# Altium project Player-Mini.PrjPcb
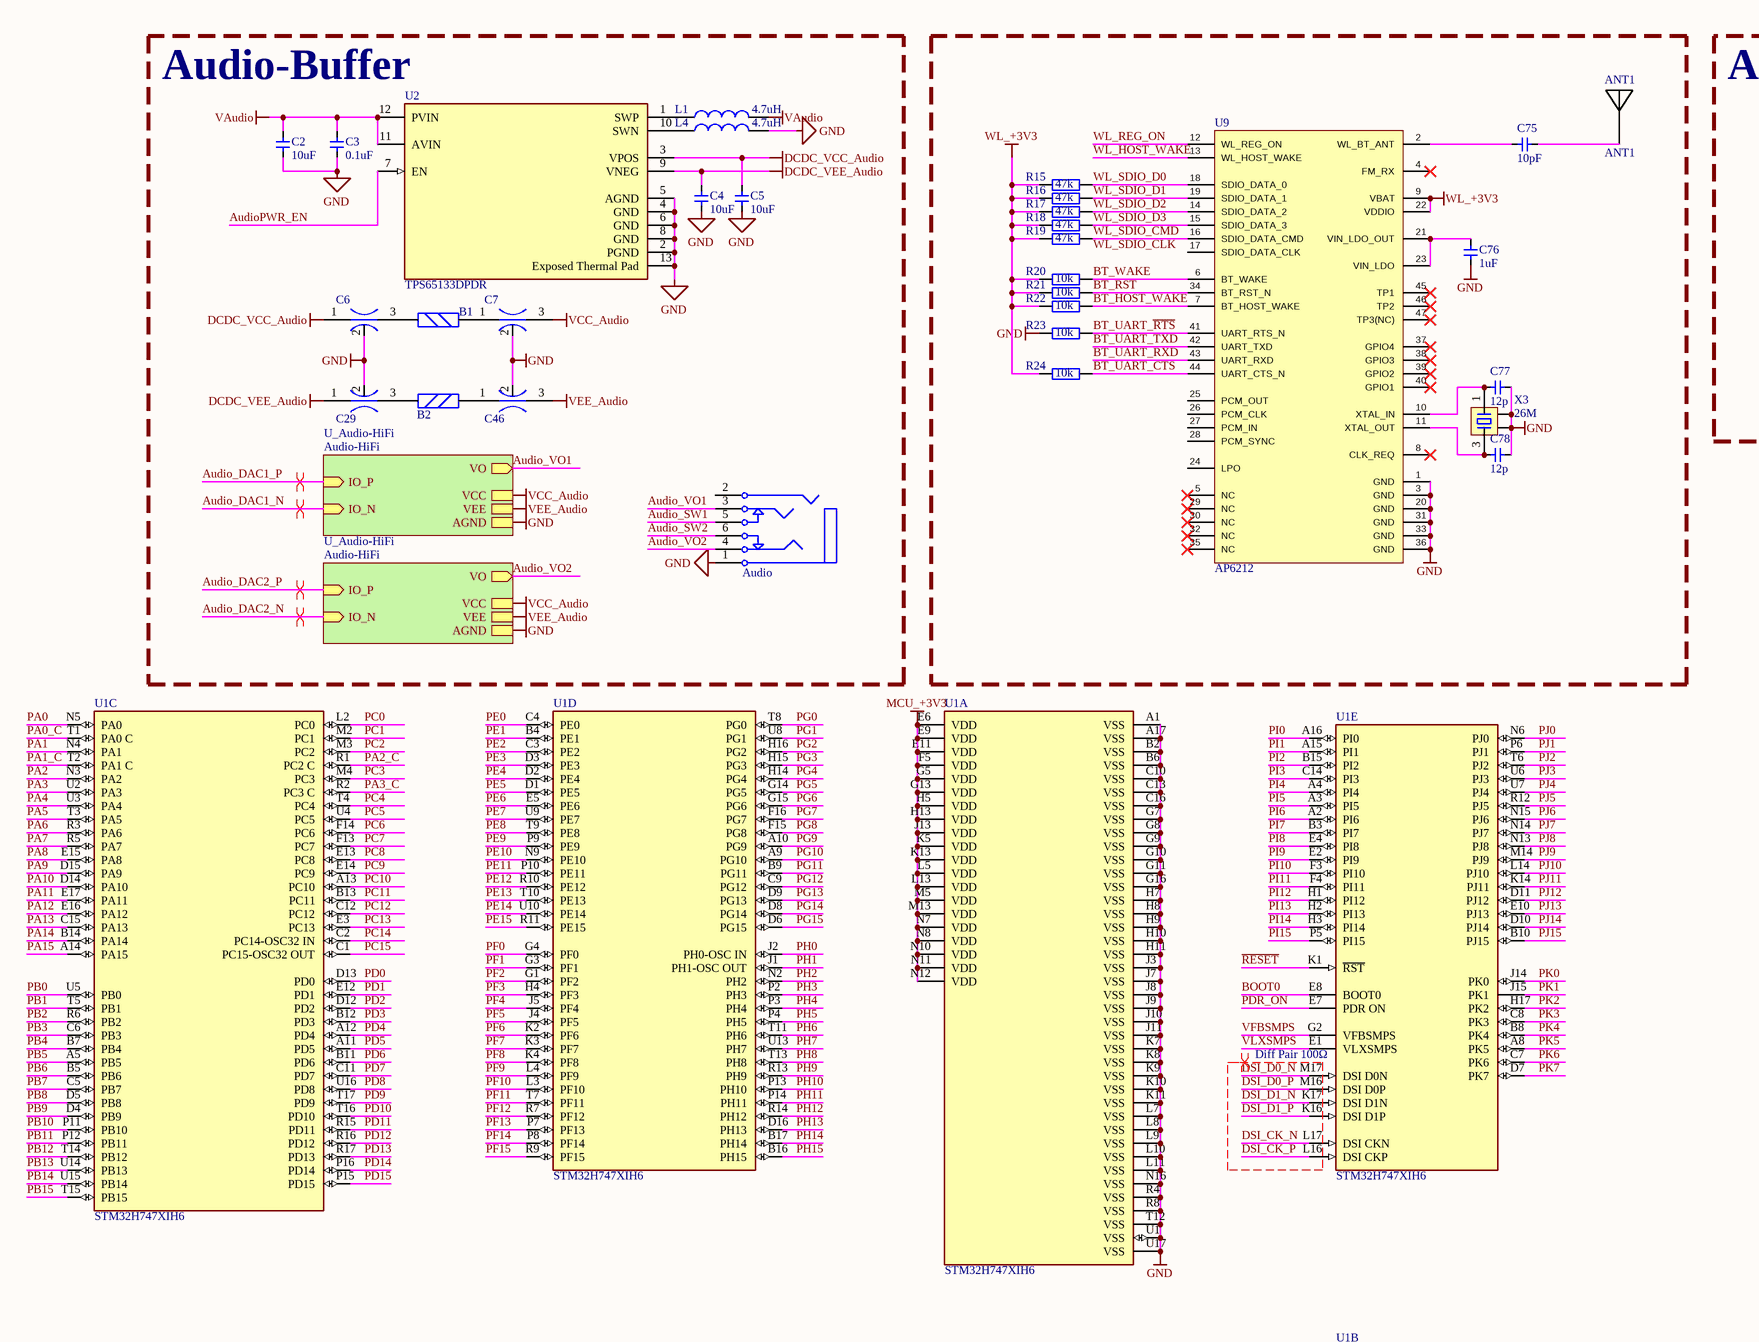
[diagram p0: Player.SchDoc, top middle]
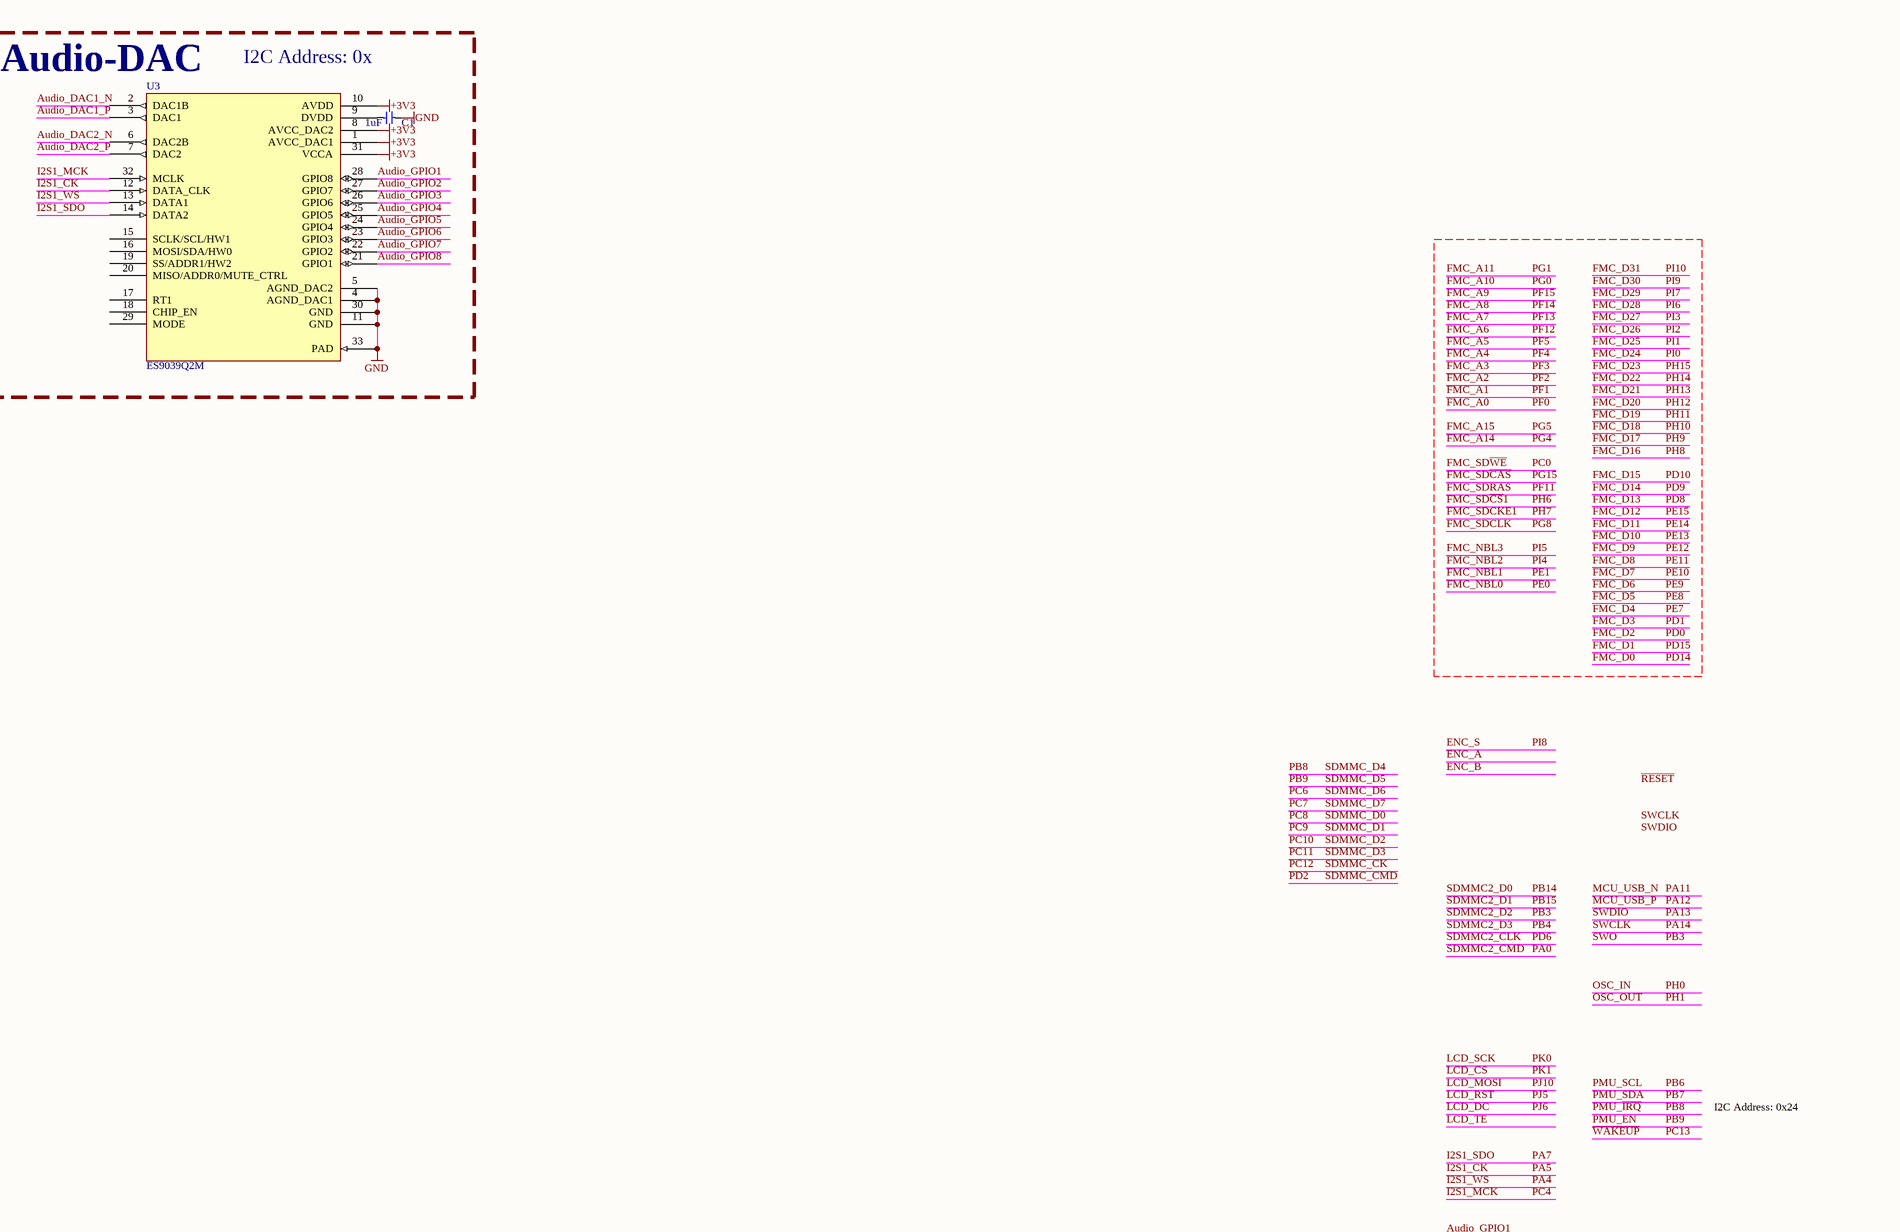
[diagram p1: Player.SchDoc, top right]
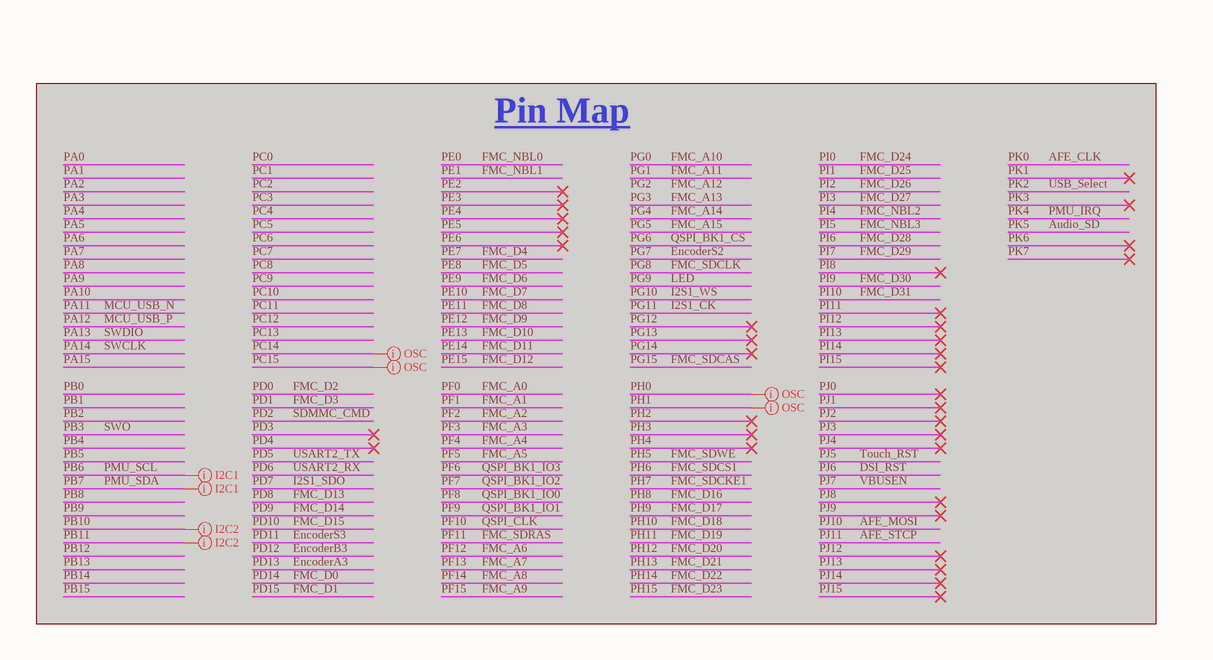
[diagram p2: Player.SchDoc, bottom left]
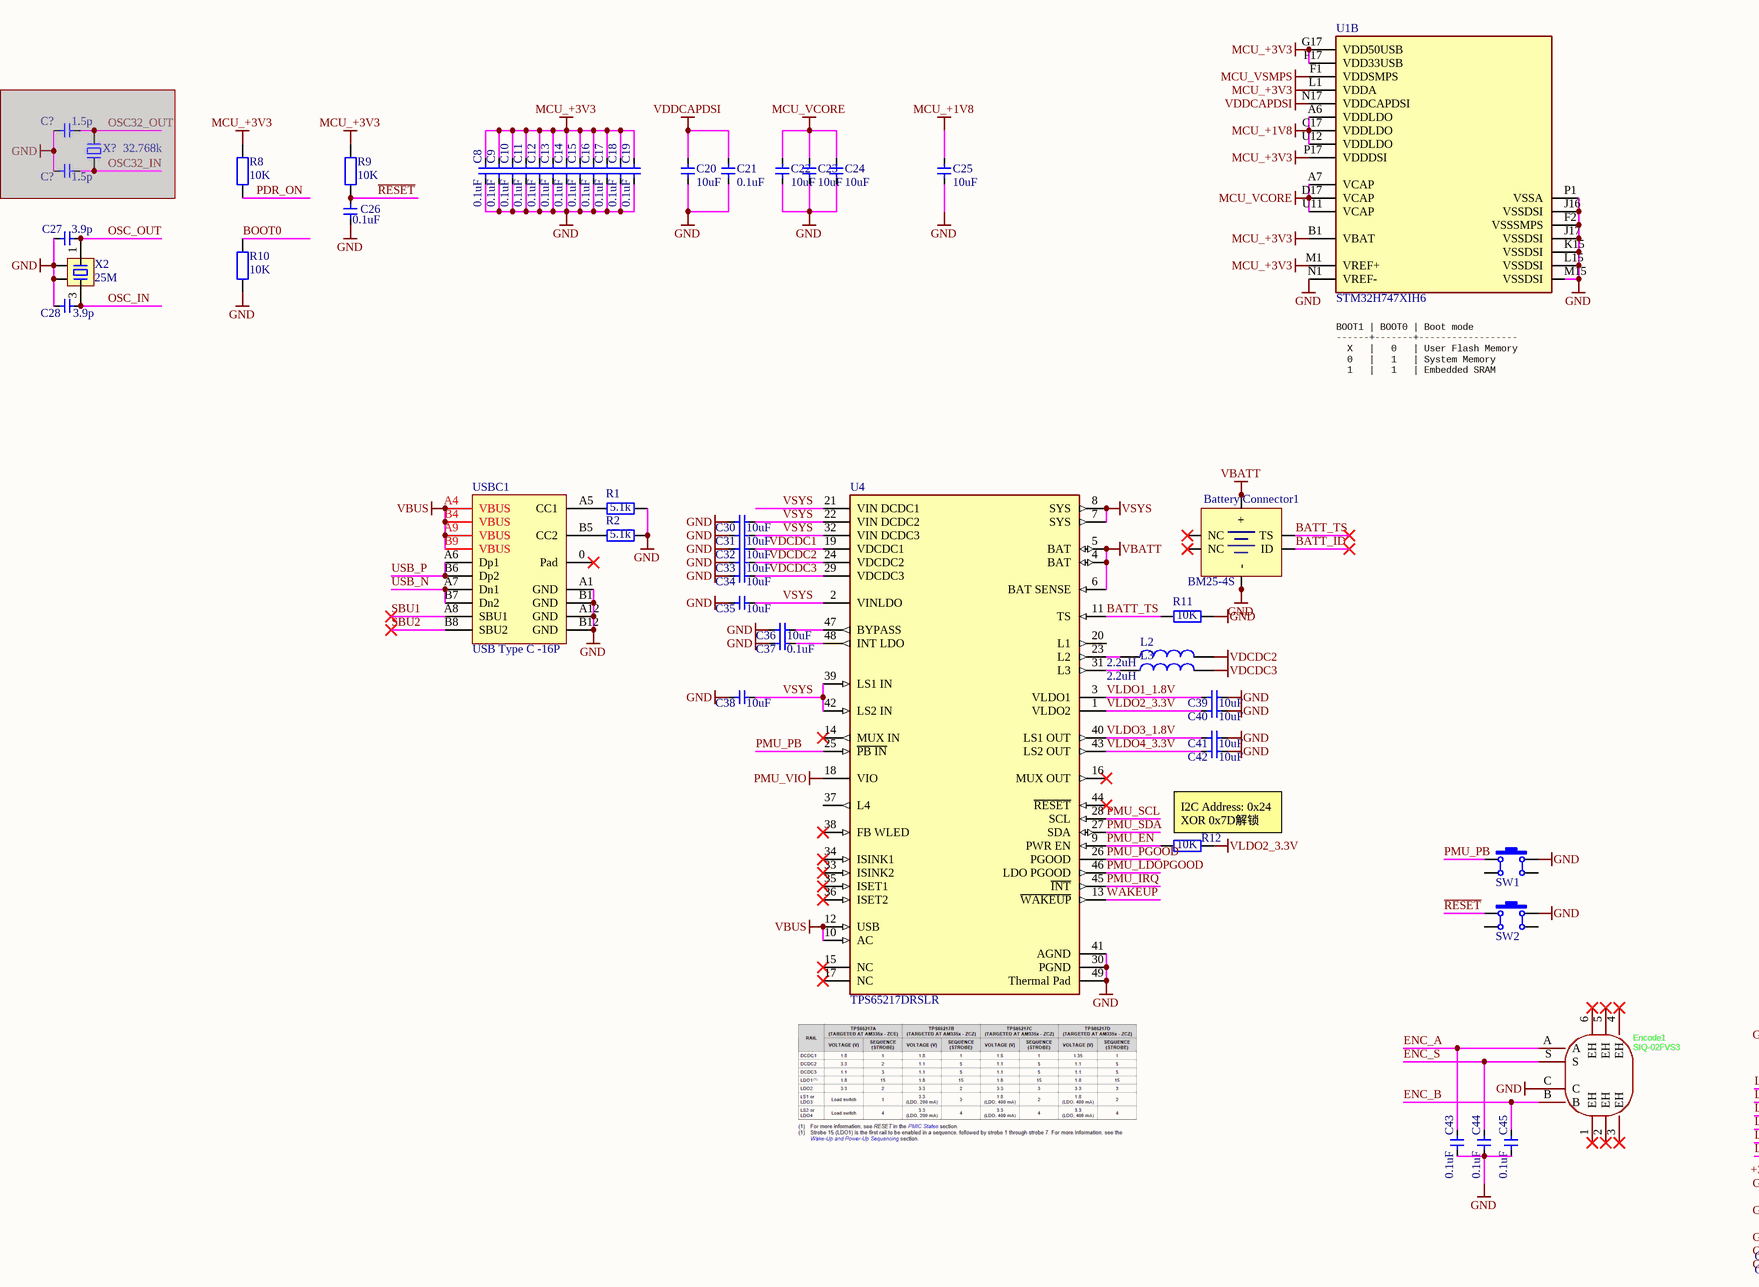
[diagram p3: Player.SchDoc, bottom middle]
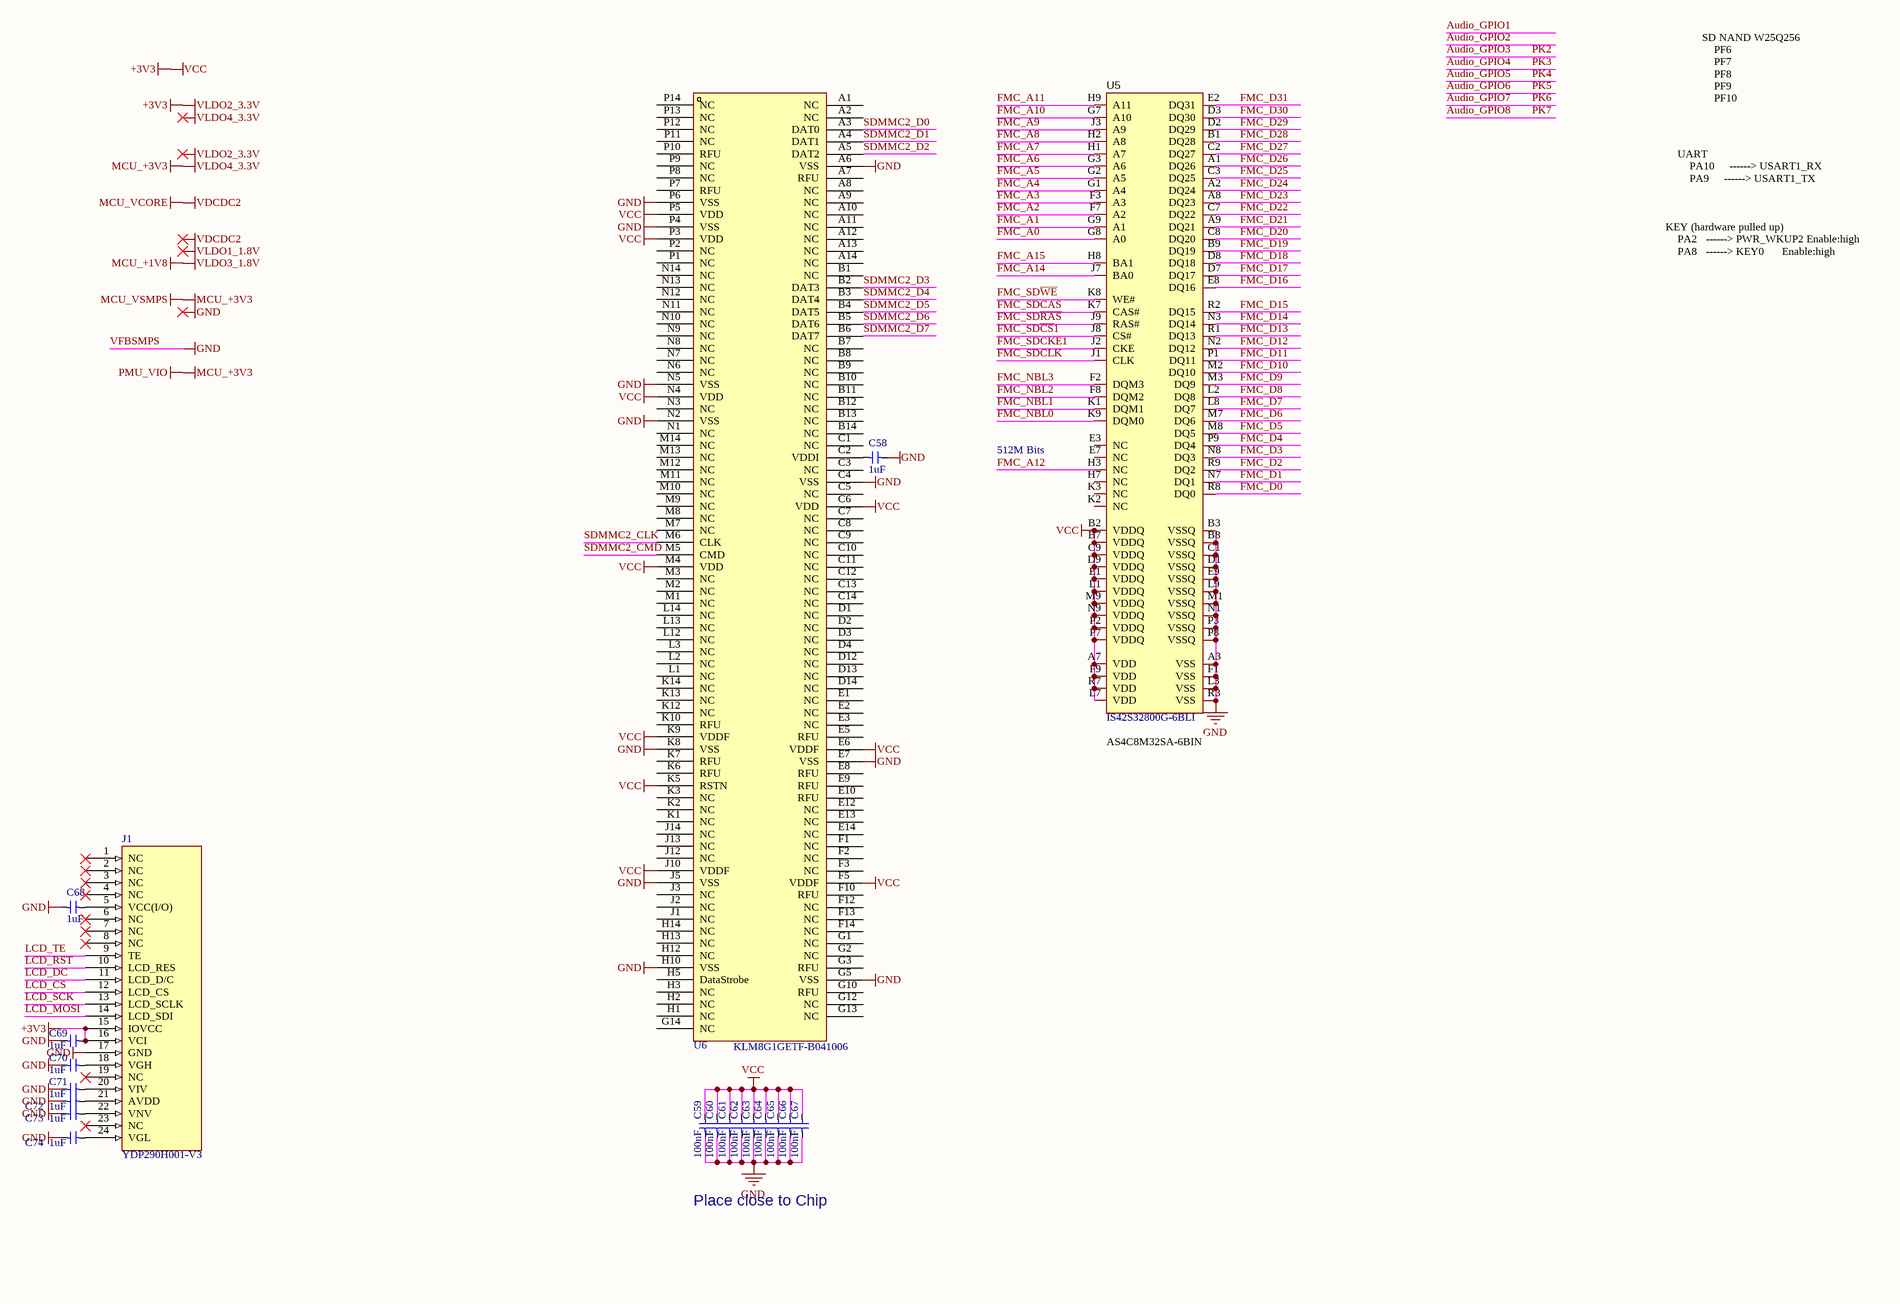
[diagram p4: Player.SchDoc, bottom right]
1 sheet, 110 parts. Net scope: hierarchical (ports join the sheet entries above them; power ports are global).
Board file: Player.PcbDoc

## Sheet Player.SchDoc
size 762 x 508 mm; SheetNumber: 1; SheetTotal: 2

### Parts
(Parts that share a designator on the sheet are numbered #1, #2 ... from top to bottom, then left to right.)
ANT1  ANT1  [2.4GANTS9]
Audio  PJ342  [PJ342A]  (value not drawn)
B1  BLM15AG601SN1D  [L0603]  (value not drawn)
B2  BLM15AG601SN1D  [L0603]  (value not drawn)
Battery_Connector1  BM25-4S  [BM25-4S/2-V-51]
C1  1uF  [0402-C]
C2  10uF  [0402-C]
C3  0.1uF  [0402-C]
C4  10uF  [0402-C]
C5  10uF  [0402-C]
C6  NFM18PS105D0J3D  [FP-NFM18-0_1-e0_05_0_35-MFG]  (value not drawn)
C7  NFM18PS105D0J3D  [FP-NFM18-0_1-e0_05_0_35-MFG]  (value not drawn)
C8  0.1uF  [0402-C]
C9  0.1uF  [0402-C]
C10  0.1uF  [0402-C]
C11  0.1uF  [0402-C]
C12  0.1uF  [0402-C]
C13  0.1uF  [0402-C]
C14  0.1uF  [0402-C]
C15  0.1uF  [0402-C]
C16  0.1uF  [0402-C]
C17  0.1uF  [0402-C]
C18  0.1uF  [0402-C]
C19  0.1uF  [0402-C]
C20  10uF  [0402-C]
C21  0.1uF  [0402-C]
C22  10uF  [0402-C]
C23  10uF  [0402-C]
C24  10uF  [0402-C]
C25  10uF  [0402-C]
C26  0.1uF  [0402-C]
C27  3.9p  [0402-C]
C28  3.9p  [0402-C]
C29  NFM18PS105D0J3D  [FP-NFM18-0_1-e0_05_0_35-MFG]  (value not drawn)
C30  10uF  [0402-C]
C31  10uF  [0402-C]
C32  10uF  [0402-C]
C33  10uF  [0402-C]
C34  10uF  [0402-C]
C35  10uF  [0402-C]
C36  10uF  [0402-C]
C37  0.1uF  [0402-C]
C38  10uF  [0402-C]
C39  10uF  [0402-C]
C40  10uF  [0402-C]
C41  10uF  [0402-C]
C42  10uF  [0402-C]
C43  0.1uF  [0402-C]
C44  0.1uF  [0402-C]
C45  0.1uF  [0402-C]
C46  NFM18PS105D0J3D  [FP-NFM18-0_1-e0_05_0_35-MFG]  (value not drawn)
C58  1uF  [0402-C]
C59  100nF  [0402-C]
C60  100nF  [0402-C]
C61  100nF  [0402-C]
C62  100nF  [0402-C]
C63  100nF  [0402-C]
C64  100nF  [0402-C]
C65  100nF  [0402-C]
C66  100nF  [0402-C]
C67  100nF  [0402-C]
C68  1uF  [0402-C]
C69  1uF  [0402-C]
C70  1uF  [0402-C]
C71  1uF  [0402-C]
C72  1uF  [0402-C]
C73  1uF  [0402-C]
C74  1uF  [0402-C]
C75  10pF  [0402-C]
C76  1uF  [0402-C]
C77  12p  [0402-C]
C78  12p  [0402-C]
C?#1  1.5p  [0402-C]  (masked out: inside a compile mask, not in the netlist)
C?#2  1.5p  [0402-C]  (masked out: inside a compile mask, not in the netlist)
Encode1  SIQ-02FVS3  [SW-SMD_SIQ-02FVS3_1]
J1  YDP290H001-V3  [FPC0.5-WT-24P]
L1  4.7uH  [L0805]
L2  2.2uH  [L0805]
L3  2.2uH  [L0805]
L4  4.7uH  [L0805]
R1  5.1k  [0603-R]
R2  5.1k  [0603-R]
R8  10K  [0603-R]
R9  10K  [0603-R]
R10  10K  [0603-R]
R11  10K  [0603-R]
R12  10K  [0603-R]
R15  47k  [0603-R]
R16  47k  [0603-R]
R17  47k  [0603-R]
R18  47k  [0603-R]
R19  47k  [0603-R]
R20  10k  [0603-R]
R21  10k  [0603-R]
R22  10k  [0603-R]
R23  10k  [0603-R]
R24  10k  [0603-R]
SW1  TD-1187SA-250  [SW-SMD-3.5*3.0_4P]  (value not drawn)
SW2  TD-1187SA-250  [SW-SMD-3.5*3.0_4P]  (value not drawn)
U1  STM32H747XIH6  [FP-TFBGA240+25-A07U-MFG]  (parts A,B,C,D,E of 5)
U2  TPS65133DPDR  [FP-DPD0012A-MFG]
U3  ES9039Q2M  [QFN32 5x5_L]
U4  TPS65217DRSLR  [FP-RSL0048A-MFG]
U5  IS42S32800G-6BLI  [BGA-90_L13.0-W8.0-R6-C15-P0.80-TL]
U6  KLM8G1GETF-B041006  [FBGA-153_L13.0-W11.5-P0.50_KLMAG1JETD-B041]
U9  AP6212  [QFN-44_L12.0-W12.0-P0.90-TL]
USBC1  USB Type C -16P  [USB-C-SMD_16P]
X2  25M  [XTAL-3225-4P]
X3  26M  [XTAL-3225-4P]
X?  32.768k  [XTAL-3215-2P]  (masked out: inside a compile mask, not in the netlist)

### Blocks framed on the sheet
Audio-Buffer: Audio B1 B2 C2-C7 C29 C46 L1 L4 U2
Audio-DAC: C1 U3

### Sub-sheets
U_Audio-HiFi = Audio-HiFi (file not in this document): IO_N (in), IO_P (in), VO (out), VCC, VEE, AGND
U_Audio-HiFi = Audio-HiFi (file not in this document): IO_N (in), IO_P (in), VO (out), VCC, VEE, AGND

### Nets
DCDC_VCC_Audio: C5.2 C6.1(Input) U2.3(VPOS)
DCDC_VEE_Audio: C4.2 C29.1(Input) U2.9(VNEG)
VAudio: C2.2 C3.2 L1.2 U2.11(AVIN) U2.12(PVIN)
VBATT: Battery_Connector1.1(+) Battery_Connector1.2(+) Battery_Connector1.9(+) Battery_Connector1.10(+) Battery_Connector1.13(+) Battery_Connector1.14(+) U4.4(BAT) U4.5(BAT) U4.6(BAT_SENSE)
VBUS: U4.10(AC) U4.12(USB) USBC1.A4(VBUS) USBC1.A9(VBUS) USBC1.B4(VBUS) USBC1.B9(VBUS)
VCC_Audio: C7.3(Output) ; sheet U_Audio-HiFi/VCC, sheet U_Audio-HiFi/VCC
VDCDC2: C22.2 C23.2 C24.2 C33.1 L2.2 U1.A7(VCAP) U1.D17(VCAP) U1.U11(VCAP) U4.24(VDCDC2)  [also labelled MCU_VCORE]
VDCDC3: C34.1 L3.2 U4.29(VDCDC3)
VDDCAPDSI: C20.2 C21.2 U1.N17(VDDCAPDSI)
VEE_Audio: C46.3(Output) ; sheet U_Audio-HiFi/VEE, sheet U_Audio-HiFi/VEE
VFBSMPS: Audio.1 Battery_Connector1.7(-) Battery_Connector1.8(-) Battery_Connector1.11(-) Battery_Connector1.12(-) Battery_Connector1.15(-) Battery_Connector1.16(-) C1.2 C2.1 C3.1 C4.1 C5.1 C6.2(GND) C7.2(GND) C8.2 C9.2 C10.2 C11.2 C12.2 C13.2 C14.2 C15.2 C16.2 C17.2 C18.2 C19.2 C20.1 C21.1 C22.1 C23.1 C24.1 C25.2 C26.2 C27.2 C28.2 C29.2(GND) C30.2 C31.2 C32.2 C33.2 C34.2 C35.2 C36.2 C37.2 C38.2 C39.1 C40.1 C41.1 C42.1 C43.2 C44.2 C45.2 C46.2(GND) C58.2 C59.2 C60.2 C61.2 C62.2 C63.2 C64.2 C65.2 C66.2 C67.2 C68.1 C69.1 C70.1 C71.1 C72.1 C73.1 C74.1 C76.1 C77.2 C78.2 Encode1.C J1.17(GND) L4.2 R1.2 R2.2 R10.1 R11.2 R23.1 SW1.2 SW2.2 U1.A1(VSS) U1.A17(VSS) U1.B2(VSS) U1.B6(VSS) U1.C10(VSS) U1.C13(VSS) U1.C16(VSS) U1.F2(VSSSMPS) U1.G2(VFBSMPS) U1.G7(VSS) U1.G8(VSS) U1.G9(VSS) U1.G10(VSS) U1.G11(VSS) U1.G16(VSS) U1.H7(VSS) U1.H8(VSS) U1.H9(VSS) U1.H10(VSS) U1.H11(VSS) U1.J3(VSS) U1.J7(VSS) U1.J8(VSS) U1.J9(VSS) U1.J10(VSS) U1.J11(VSS) U1.J16(VSSDSI) U1.J17(VSSDSI) U1.K7(VSS) U1.K8(VSS) U1.K9(VSS) U1.K10(VSS) U1.K11(VSS) U1.K15(VSSDSI) U1.L7(VSS) U1.L8(VSS) U1.L9(VSS) U1.L10(VSS) U1.L11(VSS) U1.L15(VSSDSI) U1.M15(VSSDSI) U1.N1(VREF-) U1.N16(VSS) U1.P1(VSSA) U1.R4(VSS) U1.R8(VSS) U1.T12(VSS) U1.U1(VSS) U1.U17(VSS) U2.2(PGND) U2.4(GND) U2.5(AGND) U2.6(GND) U2.8(GND) U2.13(Exposed_Thermal_Pad) U3.4(AGND_DAC1) U3.5(AGND_DAC2) U3.11(GND) U3.30(GND) U3.33(PAD) U4.30(PGND) U4.41(AGND) U4.49(Thermal_Pad) U5.A3(VSS) U5.B3(VSSQ) U5.B8(VSSQ) U5.C1(VSSQ) U5.D1(VSSQ) U5.E9(VSSQ) U5.F1(VSS) U5.L3(VSS) U5.L9(VSSQ) U5.M1(VSSQ) U5.N1(VSSQ) U5.P3(VSSQ) U5.P8(VSSQ) U5.R3(VSS) U6.A6(VSS) U6.C4(VSS) U6.E7(VSS) U6.G5(VSS) U6.H10(VSS) U6.J5(VSS) U6.K8(VSS) U6.N2(VSS) U6.N5(VSS) U6.P4(VSS) U6.P6(VSS) U9.1(GND) U9.3(GND) U9.20(GND) U9.31(GND) U9.33(GND) U9.36(GND) USBC1.A1(GND) USBC1.A12(GND) USBC1.B1(GND) USBC1.B12(GND) X2.2 X2.4 X3.2 X3.4 ; sheet U_Audio-HiFi/AGND, sheet U_Audio-HiFi/AGND  [also labelled GND]
VLDO1_1.8V: C39.2 U4.3(VLDO1)
VLDO2_3.3V: C40.2 C59.1 C60.1 C61.1 C62.1 C63.1 C64.1 C65.1 C66.1 C67.1 C69.2 J1.15(IOVCC) J1.16(VCI) R12.2 U3.1(AVCC_DAC1) U3.8(AVCC_DAC2) U3.10(AVDD) U3.31(VCCA) U4.1(VLDO2) U5.A7(VDD) U5.B2(VDDQ) U5.B7(VDDQ) U5.C9(VDDQ) U5.D9(VDDQ) U5.E1(VDDQ) U5.F9(VDD) U5.L1(VDDQ) U5.L7(VDD) U5.M9(VDDQ) U5.N9(VDDQ) U5.P2(VDDQ) U5.P7(VDDQ) U5.R7(VDD) U6.C6(VDD) U6.E6(VDDF) U6.F5(VDDF) U6.J10(VDDF) U6.K5(RSTN) U6.K9(VDDF) U6.M4(VDD) U6.N4(VDD) U6.P3(VDD) U6.P5(VDD)  [also labelled +3V3, VCC]
VLDO3_1.8V: C25.1 C41.2 U1.A6(VDDLDO) U1.C17(VDDLDO) U1.U12(VDDLDO) U4.40(LS1_OUT)  [also labelled MCU_+1V8]
VLDO4_3.3V: C8.1 C9.1 C10.1 C11.1 C12.1 C13.1 C14.1 C15.1 C16.1 C17.1 C18.1 C19.1 C42.2 R8.2 R9.2 U1.B1(VBAT) U1.E6(VDD) U1.E9(VDD) U1.E11(VDD) U1.F1(VDDSMPS) U1.F5(VDD) U1.F17(VDD33USB) U1.G5(VDD) U1.G13(VDD) U1.G17(VDD50USB) U1.H5(VDD) U1.H13(VDD) U1.J13(VDD) U1.K5(VDD) U1.K13(VDD) U1.L1(VDDA) U1.L5(VDD) U1.L13(VDD) U1.M1(VREF+) U1.M5(VDD) U1.M13(VDD) U1.N7(VDD) U1.N8(VDD) U1.N10(VDD) U1.N11(VDD) U1.N12(VDD) U1.P17(VDDDSI) U4.18(VIO) U4.43(LS2_OUT)  [also labelled MCU_+3V3, MCU_VSMPS, PMU_VIO]
VSYS: C30.1 C31.1 C35.1 C38.1 U4.2(VINLDO) U4.7(SYS) U4.8(SYS) U4.21(VIN_DCDC1) U4.22(VIN_DCDC2) U4.32(VIN_DCDC3) U4.39(LS1_IN) U4.42(LS2_IN)
WL_+3V3: R15.1 R16.1 R17.1 R18.1 R19.1 R20.1 R21.1 R22.1 R24.1 U9.9(VBAT) U9.22(VDDIO)
Audio_DAC1_N: U3.2(DAC1B) ; sheet U_Audio-HiFi/IO_N
Audio_DAC1_P: U3.3(DAC1) ; sheet U_Audio-HiFi/IO_P
Audio_DAC2_N: U3.6(DAC2B) ; sheet U_Audio-HiFi/IO_N
Audio_DAC2_P: U3.7(DAC2) ; sheet U_Audio-HiFi/IO_P
Audio_GPIO1: U3.28(GPIO8)
Audio_GPIO2: U3.27(GPIO7)
Audio_GPIO3: U1.H17(PK2) U3.26(GPIO6)  [also labelled PK2]
Audio_GPIO4: U1.C8(PK3) U3.25(GPIO5)  [also labelled PK3]
Audio_GPIO5: U1.B8(PK4) U3.24(GPIO4)  [also labelled PK4]
Audio_GPIO6: U1.A8(PK5) U3.23(GPIO3)  [also labelled PK5]
Audio_GPIO7: U1.C7(PK6) U3.22(GPIO2)  [also labelled PK6]
Audio_GPIO8: U1.D7(PK7) U3.21(GPIO1)  [also labelled PK7]
Audio_SW1: Audio.5
Audio_SW2: Audio.6
Audio_VO1: Audio.3 ; sheet U_Audio-HiFi/VO
Audio_VO2: Audio.4 ; sheet U_Audio-HiFi/VO
AudioPWR_EN: U2.7(EN)
BATT_ID: Battery_Connector1.4(ID)
BATT_TS: Battery_Connector1.3(TS) R11.1 U4.11(TS)
BOOT0: R10.2 U1.E8(BOOT0)
BT_HOST_WAKE: R22.2 U9.7(BT_HOST_WAKE)
BT_~{RST}: R21.2 U9.34(BT_RST_N)
BT_UART_~{CTS}: R24.2 U9.44(UART_CTS_N)
BT_UART_~{RTS}: R23.2 U9.41(UART_RTS_N)
BT_UART_RXD: U9.43(UART_RXD)
BT_UART_TXD: U9.42(UART_TXD)
BT_WAKE: R20.2 U9.6(BT_WAKE)
DSI_CK_N: U1.L17(DSI_CKN)
DSI_CK_P: U1.L16(DSI_CKP)
DSI_D0_N: U1.M17(DSI_D0N)
DSI_D0_P: U1.M16(DSI_D0P)
DSI_D1_N: U1.K17(DSI_D1N)
DSI_D1_P: U1.K16(DSI_D1P)
ENC_A: C43.1 Encode1.A
ENC_B: C45.1 Encode1.B
ENC_S: C44.1 Encode1.S U1.E4(PI8)  [also labelled PI8]
FMC_A0: U1.G4(PF0) U5.G8(A0)  [also labelled PF0]
FMC_A1: U1.G3(PF1) U5.G9(A1)  [also labelled PF1]
FMC_A2: U1.G1(PF2) U5.F7(A2)  [also labelled PF2]
FMC_A3: U1.H4(PF3) U5.F3(A3)  [also labelled PF3]
FMC_A4: U1.J5(PF4) U5.G1(A4)  [also labelled PF4]
FMC_A5: U1.J4(PF5) U5.G2(A5)  [also labelled PF5]
FMC_A6: U1.R7(PF12) U5.G3(A6)  [also labelled PF12]
FMC_A7: U1.P7(PF13) U5.H1(A7)  [also labelled PF13]
FMC_A8: U1.P8(PF14) U5.H2(A8)  [also labelled PF14]
FMC_A9: U1.R9(PF15) U5.J3(A9)  [also labelled PF15]
FMC_A10: U1.T8(PG0) U5.G7(A10)  [also labelled PG0]
FMC_A11: U1.U8(PG1) U5.H9(A11)  [also labelled PG1]
FMC_A12: U5.H3(NC)
FMC_A14: U1.H14(PG4) U5.J7(BA0)  [also labelled PG4]
FMC_A15: U1.G14(PG5) U5.H8(BA1)  [also labelled PG5]
FMC_D0: U1.P16(PD14) U5.R8(DQ0)  [also labelled PD14]
FMC_D1: U1.P15(PD15) U5.N7(DQ1)  [also labelled PD15]
FMC_D2: U1.D13(PD0) U5.R9(DQ2)  [also labelled PD0]
FMC_D3: U1.E12(PD1) U5.N8(DQ3)  [also labelled PD1]
FMC_D4: U1.U9(PE7) U5.P9(DQ4)  [also labelled PE7]
FMC_D5: U1.T9(PE8) U5.M8(DQ5)  [also labelled PE8]
FMC_D6: U1.P9(PE9) U5.M7(DQ6)  [also labelled PE9]
FMC_D7: U1.N9(PE10) U5.L8(DQ7)  [also labelled PE10]
FMC_D8: U1.P10(PE11) U5.L2(DQ8)  [also labelled PE11]
FMC_D9: U1.R10(PE12) U5.M3(DQ9)  [also labelled PE12]
FMC_D10: U1.T10(PE13) U5.M2(DQ10)  [also labelled PE13]
FMC_D11: U1.U10(PE14) U5.P1(DQ11)  [also labelled PE14]
FMC_D12: U1.R11(PE15) U5.N2(DQ12)  [also labelled PE15]
FMC_D13: U1.U16(PD8) U5.R1(DQ13)  [also labelled PD8]
FMC_D14: U1.T17(PD9) U5.N3(DQ14)  [also labelled PD9]
FMC_D15: U1.T16(PD10) U5.R2(DQ15)  [also labelled PD10]
FMC_D16: U1.T13(PH8) U5.E8(DQ16)  [also labelled PH8]
FMC_D17: U1.R13(PH9) U5.D7(DQ17)  [also labelled PH9]
FMC_D18: U1.P13(PH10) U5.D8(DQ18)  [also labelled PH10]
FMC_D19: U1.P14(PH11) U5.B9(DQ19)  [also labelled PH11]
FMC_D20: U1.R14(PH12) U5.C8(DQ20)  [also labelled PH12]
FMC_D21: U1.D16(PH13) U5.A9(DQ21)  [also labelled PH13]
FMC_D22: U1.B17(PH14) U5.C7(DQ22)  [also labelled PH14]
FMC_D23: U1.B16(PH15) U5.A8(DQ23)  [also labelled PH15]
FMC_D24: U1.A16(PI0) U5.A2(DQ24)  [also labelled PI0]
FMC_D25: U1.A15(PI1) U5.C3(DQ25)  [also labelled PI1]
FMC_D26: U1.B15(PI2) U5.A1(DQ26)  [also labelled PI2]
FMC_D27: U1.C14(PI3) U5.C2(DQ27)  [also labelled PI3]
FMC_D28: U1.A2(PI6) U5.B1(DQ28)  [also labelled PI6]
FMC_D29: U1.B3(PI7) U5.D2(DQ29)  [also labelled PI7]
FMC_D30: U1.E2(PI9) U5.D3(DQ30)  [also labelled PI9]
FMC_D31: U1.F3(PI10) U5.E2(DQ31)  [also labelled PI10]
FMC_NBL0: U1.C4(PE0) U5.K9(DQM0)  [also labelled PE0]
FMC_NBL1: U1.B4(PE1) U5.K1(DQM1)  [also labelled PE1]
FMC_NBL2: U1.A4(PI4) U5.F8(DQM2)  [also labelled PI4]
FMC_NBL3: U1.A3(PI5) U5.F2(DQM3)  [also labelled PI5]
FMC_SD~{CAS}: U1.D6(PG15) U5.K7(CAS#)  [also labelled PG15]
FMC_SD~{CS}1: U1.T11(PH6) U5.J8(CS#)  [also labelled PH6]
FMC_SDCKE1: U1.U13(PH7) U5.J2(CKE)  [also labelled PH7]
FMC_SDCLK: U1.F15(PG8) U5.J1(CLK)  [also labelled PG8]
FMC_SD~{RAS}: U1.T7(PF11) U5.J9(RAS#)  [also labelled PF11]
FMC_SD~{WE}: U1.L2(PC0) U5.K8(WE#)  [also labelled PC0]
I2S1_CK: U1.T3(PA5) U3.12(DATA_CLK)  [also labelled PA5]
I2S1_MCK: U1.T4(PC4) U3.32(MCLK)  [also labelled PC4]
I2S1_SDO: U1.R5(PA7) U3.14(DATA2)  [also labelled PA7]
I2S1_WS: U1.U3(PA4) U3.13(DATA1)  [also labelled PA4]
LCD_CS: J1.12(LCD_CS) U1.J15(PK1)  [also labelled PK1]
LCD_DC: J1.11(LCD_D/C) U1.N15(PJ6)  [also labelled PJ6]
LCD_MOSI: J1.14(LCD_SDI) U1.L14(PJ10)  [also labelled PJ10]
LCD_RST: J1.10(LCD_RES) U1.R12(PJ5)  [also labelled PJ5]
LCD_SCK: J1.13(LCD_SCLK) U1.J14(PK0)  [also labelled PK0]
LCD_TE: J1.9(TE)
MCU_USB_N: U1.E17(PA11)  [also labelled PA11]
MCU_USB_P: U1.E16(PA12)  [also labelled PA12]
OSC_IN: C28.1 U1.J2(PH0-OSC_IN) X2.3  [also labelled PH0]
OSC_OUT: C27.1 U1.J1(PH1-OSC_OUT) X2.1  [also labelled PH1]
PA0: U1.N5(PA0) U6.M5(CMD)  [also labelled SDMMC2_CMD]
PA0_C: U1.T1(PA0_C)
PA1: U1.N4(PA1)
PA1_C: U1.T2(PA1_C)
PA2: U1.N3(PA2)
PA2_C: U1.R1(PC2_C)
PA3: U1.U2(PA3)
PA3_C: U1.R2(PC3_C)
PA6: U1.R3(PA6)
PA8: U1.E15(PA8)
PA9: U1.D15(PA9)
PA10: U1.D14(PA10)
PA13: U1.C15(PA13)  [also labelled SWDIO]
PA14: U1.B14(PA14)  [also labelled SWCLK]
PA15: U1.A14(PA15)
PB0: U1.U5(PB0)
PB1: U1.T5(PB1)
PB2: U1.R6(PB2)
PB3: U1.C6(PB3) U6.A5(DAT2)  [also labelled SDMMC2_D2, SWO]
PB4: U1.B7(PB4) U6.B2(DAT3)  [also labelled SDMMC2_D3]
PB5: U1.A5(PB5)
PB6: U1.B5(PB6) U4.28(SCL)  [also labelled PMU_SCL]
PB7: U1.C5(PB7) U4.27(SDA)  [also labelled PMU_SDA]
PB8: U1.D5(PB8) U4.45(~{INT})  [also labelled PMU_~{IRQ}, SDMMC_D4]
PB9: R12.1 U1.D4(PB9) U4.9(PWR_EN)  [also labelled PMU_EN, SDMMC_D5]
PB10: U1.P11(PB10)
PB11: U1.P12(PB11)
PB12: U1.T14(PB12)
PB13: U1.U14(PB13)
PB14: U1.U15(PB14) U6.A3(DAT0)  [also labelled SDMMC2_D0]
PB15: U1.T15(PB15) U6.A4(DAT1)  [also labelled SDMMC2_D1]
PC1: U1.M2(PC1)
PC2: U1.M3(PC2)
PC3: U1.M4(PC3)
PC5: U1.U4(PC5)
PC6: U1.F14(PC6)  [also labelled SDMMC_D6]
PC7: U1.F13(PC7)  [also labelled SDMMC_D7]
PC8: U1.E13(PC8)  [also labelled SDMMC_D0]
PC9: U1.E14(PC9)  [also labelled SDMMC_D1]
PC10: U1.A13(PC10)  [also labelled SDMMC_D2]
PC11: U1.B13(PC11)  [also labelled SDMMC_D3]
PC12: U1.C12(PC12)  [also labelled SDMMC_CK]
PC13: U1.E3(PC13) U4.13(~{WAKEUP})  [also labelled ~{WAKEUP}]
PC14: U1.C2(PC14-OSC32_IN)
PC15: U1.C1(PC15-OSC32_OUT)
PD2: U1.D12(PD2)  [also labelled SDMMC_CMD]
PD3: U1.B12(PD3)
PD4: U1.A12(PD4)
PD5: U1.A11(PD5)
PD6: U1.B11(PD6) U6.M6(CLK)  [also labelled SDMMC2_CLK]
PD7: U1.C11(PD7)
PD11: U1.R15(PD11)
PD12: U1.R16(PD12)
PD13: U1.R17(PD13)
PDR_ON: R8.1 U1.E7(PDR_ON)
PE2: U1.C3(PE2)
PE3: U1.D3(PE3)
PE4: U1.D2(PE4)
PE5: U1.D1(PE5)
PE6: U1.E5(PE6)
PF6: U1.K2(PF6)
PF7: U1.K3(PF7)
PF8: U1.K4(PF8)
PF9: U1.L4(PF9)
PF10: U1.L3(PF10)
PG2: U1.H16(PG2)
PG3: U1.H15(PG3)
PG6: U1.G15(PG6)
PG7: U1.F16(PG7)
PG9: U1.A10(PG9)
PG10: U1.A9(PG10)
PG11: U1.B9(PG11)
PG12: U1.C9(PG12)
PG13: U1.D9(PG13)
PG14: U1.D8(PG14)
PH2: U1.N2(PH2)
PH3: U1.P2(PH3)
PH4: U1.P3(PH4)
PH5: U1.P4(PH5)
PI11: U1.F4(PI11)
PI12: U1.H1(PI12)
PI13: U1.H2(PI13)
PI14: U1.H3(PI14)
PI15: U1.P5(PI15)
PJ0: U1.N6(PJ0)
PJ1: U1.P6(PJ1)
PJ2: U1.T6(PJ2)
PJ3: U1.U6(PJ3)
PJ4: U1.U7(PJ4)
PJ7: U1.N14(PJ7)
PJ8: U1.N13(PJ8)
PJ9: U1.M14(PJ9)
PJ11: U1.K14(PJ11)
PJ12: U1.D11(PJ12)
PJ13: U1.E10(PJ13)
PJ14: U1.D10(PJ14)
PJ15: U1.B10(PJ15)
PMU_LDOPGOOD: U4.46(LDO_PGOOD)
PMU_PB: SW1.1 U4.25(~{PB_IN})
PMU_PGOOD: U4.26(PGOOD)
~{RESET}: C26.1 R9.1 SW2.1 U1.K1(~{RST})
SBU1: USBC1.A8(SBU1)
SBU2: USBC1.B8(SBU2)
SDMMC2_D4: U6.B3(DAT4)
SDMMC2_D5: U6.B4(DAT5)
SDMMC2_D6: U6.B5(DAT6)
SDMMC2_D7: U6.B6(DAT7)
USB_N: USBC1.A7(Dn1) USBC1.B7(Dn2)
USB_P: USBC1.A6(Dp1) USBC1.B6(Dp2)
VDCDC1: C32.1 U4.19(VDCDC1)
VLXSMPS: U1.E1(VLXSMPS)
WL_HOST_WAKE: U9.13(WL_HOST_WAKE)
WL_REG_ON: U9.12(WL_REG_ON)
WL_SDIO_CMD: R19.2 U9.16(SDIO_DATA_CMD)
WL_SDIO_D0: R15.2 U9.18(SDIO_DATA_0)
WL_SDIO_D1: R16.2 U9.19(SDIO_DATA_1)
WL_SDIO_D2: R17.2 U9.14(SDIO_DATA_2)
WL_SDIO_D3: R18.2 U9.15(SDIO_DATA_3)
NetANT1_1: ANT1.1 C75.2
NetB1_1: B1.1 C7.1(Input)
NetB1_2: B1.2 C6.3(Output)
NetB2_1: B2.1 C46.1(Input)
NetB2_2: B2.2 C29.3(Output)
NetC1_1: C1.1 U3.9(DVDD)
NetC36_1: C36.1 U4.47(BYPASS)
NetC37_1: C37.1 U4.48(INT_LDO)
NetC58_1: C58.1 U6.C2(VDDI)
NetC68_2: C68.2 J1.5(VCC(I/O))
NetC70_2: C70.2 J1.18(VGH)
NetC71_2: C71.2 J1.20(VIV)
NetC72_2: C72.2 J1.21(AVDD)
NetC73_2: C73.2 J1.22(VNV)
NetC74_2: C74.2 J1.24(VGL)
NetC75_1: C75.1 U9.2(WL_BT_ANT)
NetC76_2: C76.2 U9.21(VIN_LDO_OUT) U9.23(VIN_LDO)
NetC77_1: C77.1 U9.10(XTAL_IN) X3.1
NetC78_1: C78.1 U9.11(XTAL_OUT) X3.3
NetL1_1: L1.1 U2.1(SWP)
NetL2_1: L2.1 U4.23(L2)
NetL3_1: L3.1 U4.31(L3)
NetL4_1: L4.1 U2.10(SWN)
NetR1_1: R1.1 USBC1.A5(CC1)
NetR2_1: R2.1 USBC1.B5(CC2)

Not connected (* = marked no-connect by the designer): Audio 2; Battery_Connector1 5(NC)* 6(NC)*; Encode1 1(EH)* 2(EH)* 3(EH)* 4(EH)* 5(EH)* 6(EH)*; J1 1(NC)* 2(NC)* 3(NC)* 4(NC)* 6(NC)* 7(NC)* 8(NC)* 19(NC)* 23(NC)*; SW1 3 4; SW2 3 4; U3 15(SCLK/SCL/HW1) 16(MOSI/SDA/HW0) 17(RT1) 18(CHIP_EN) 19(SS/ADDR1/HW2) 20(MISO/ADDR0/MUTE_CTRL) 29(MODE); U4 14(MUX_IN)* 15(NC)* 16(MUX_OUT)* 17(NC)* 20(L1) 33(ISINK2)* 34(ISINK1)* 35(ISET1)* 36(ISET2)* 37(L4) 38(FB_WLED)* 44(~{RESET})*; U5 E3(NC) E7(NC) H7(NC) K2(NC) K3(NC); U6 A1(NC) A2(NC) A7(RFU) A8(NC) A9(NC) A10(NC) A11(NC) A12(NC) A13(NC) A14(NC) B1(NC) B7(NC) B8(NC) B9(NC) B10(NC) B11(NC) B12(NC) B13(NC) B14(NC) C1(NC) C3(NC) C5(NC) C7(NC) C8(NC) C9(NC) C10(NC) C11(NC) C12(NC) C13(NC) C14(NC) D1(NC) D2(NC) D3(NC) D4(NC) D12(NC) D13(NC) D14(NC) E1(NC) E2(NC) E3(NC) E5(RFU) E8(RFU) E9(RFU) E10(RFU) E12(NC) E13(NC) E14(NC) F1(NC) F2(NC) F3(NC) F10(RFU) F12(NC) F13(NC) F14(NC) G1(NC) G2(NC) G3(RFU) G10(RFU) G12(NC) G13(NC) G14(NC) H1(NC) H2(NC) H3(NC) H5(DataStrobe) H12(NC) H13(NC) H14(NC) J1(NC) J2(NC) J3(NC) J12(NC) J13(NC) J14(NC) K1(NC) K2(NC) K3(NC) K6(RFU) K7(RFU) K10(RFU) K12(NC) K13(NC) K14(NC) L1(NC) L2(NC) L3(NC) L12(NC) L13(NC) L14(NC) M1(NC) M2(NC) M3(NC) M7(NC) M8(NC) M9(NC) M10(NC) M11(NC) M12(NC) M13(NC) M14(NC) N1(NC) N3(NC) N6(NC) N7(NC) N8(NC) N9(NC) N10(NC) N11(NC) N12(NC) N13(NC) N14(NC) P1(NC) P2(NC) P7(RFU) P8(NC) P9(NC) P10(RFU) P11(NC) P12(NC) P13(NC) P14(NC); U9 4(FM_RX)* 5(NC)* 8(CLK_REQ)* 17(SDIO_DATA_CLK) 24(LPO) 25(PCM_OUT) 26(PCM_CLK) 27(PCM_IN) 28(PCM_SYNC) 29(NC)* 30(NC)* 32(NC)* 35(NC)* 37(GPIO4)* 38(GPIO3)* 39(GPIO2)* 40(GPIO1)* 45(TP1)* 46(TP2)* 47(TP3(NC))*; USBC1 0(Pad)*

### Layout directives
I2C Address:: 0X: (no net found under the mark)
mark named I2C1: (no net found under the mark)
mark named I2C2: (no net found under the mark)
differential pair; Parameter 1: Diff Pair 100Ω; rule Differential Pairs Routing [Pref Gap = 6mil    Min Gap  = 4mil    Max Gap  = 10milPref Width = 6mil    Min Width  = 4mil    Max Width  = 15mil]; differential pair class MIPI; net class MIPI; rule Matched Net Lengths [Tolerance = 50mil]: DSI_CK_N, DSI_CK_P, DSI_D0_N, DSI_D0_P, DSI_D1_N, DSI_D1_P
differential pair: Audio_DAC1_N, Audio_DAC1_P, Audio_DAC2_N, Audio_DAC2_P

### Notes on the sheet
- I2C Address: 0x
- I2C Address: 0x24
- Ceramic capacitor (Low ESR <600m ohm)
- SD NAND W25Q256
  PF6
  PF7
  PF8
  PF9
  PF10
- UART
  PA10     ------> USART1_RX
  PA9     ------> USART1_TX
- KEY (hardware pulled up)
  PA2   ------> PWR_WKUP2 Enable:high
  PA8   ------> KEY0      Enable:high
- (near U1) BOOT1 | BOOT0 | Boot mode
  ------+-------+------------------
  X   |   0   | User Flash Memory
  0   |   1   | System Memory
  1   |   1   | Embedded SRAM
- 512M Bits
- (near R12) I2C Address: 0x24
  XOR 0x7D解锁
- (near U5) AS4C8M32SA-6BIN
- Pin Map
- Place close to Chip
- Labels drawn without touching a wire or pin: GND, SWCLK, SWDIO, VDCDC2, VLDO1_1.8V, VLDO2_3.3V, VLDO4_3.3V, WL_SDIO_CLK, ~{RESET}

### Library data of the parts
ANT1 = ANT1: PCB板载天线; 当前库版本V2023.8.14 @淘宝卖家:黄晶宝石: 最新版本发布https://item.taobao.com/item.htm?id=566775463719; 联系下单店铺卖家 免费技术支持: 联系下单店铺卖家 免费帮你查找封装; BOM名称: PCB板载天线
Audio = PJ342: 3.5耳机插座,4Pin; BOM名称: 耳机插座; 当前库版本V2023.8.14 @淘宝卖家:黄晶宝石: 最新版本发布https://item.taobao.com/item.htm?id=566775463719
B1 B2 = BEAD
Battery_Connector1 = BM25-4S/2-V-51: Battery
C1-C5 C8-C28 C30-C45 C58-C78 C?#1 C?#2 = 电容-0402: Capacitor; Value: 0.1u
C6 C7 C29 C46 = CMP-06053-000028-1: CAP FEEDTHRU 1UF 20% 6.3V 0603; DC Resistance (DCR): 30mR; Current: 2A; Length: 0.063inch; Package Quantity: 4000; Capacitance: 1uF; Height: 0.028inch; Mount: Surface Mount; Max Operating Temperature: 125°C; Voltage Rating: 6.3V; Case/Package: 0603; Tolerance: 20%; Case Code (Metric): 1608; Min Operating Temperature: -55°C; Packaging: Tape and Reel; Case Code (Imperial): 0603; Voltage Rating (DC): 6.3V; Width: 0.031inch
Encode1 = SIQ-02FVS3: Manufacturer: MITSUMI(美上美); Add into BOM: yes; Symbol: SIQ-02FVS3; Device: SIQ-02FVS3; LCSC Part Name: 拨轮滚轮旋转编码器开关; Supplier Part: C2925423; Manufacturer Part: SIQ-02FVS3; Supplier Footprint: SMD; JLCPCB Part Class: Extended Part; Datasheet: https://atta.szlcsc.com/upload/public/pdf/source/20220728/2FBC1A98A06DC86460FC69DAE20456FC.pdf; Supplier: LCSC; Convert to PCB: yes
J1 = YDP290H001-V3: 鱼鹰光电
L1-L4 = L: 贴片小功率电感; BOM名称: 小功率贴片电感; 联系下单店铺卖家 免费帮你查找封装: 联系下单店铺卖家 免费技术支持
R1 R2 R8-R12 R15-R24 = R: 贴片电阻; 联系卖家，免费查找封装: 唯一出售店铺网址https://shop463601444.taobao.com; BOM名称: 贴片电阻
SW1 SW2 = TD-1187SA-250: 小乌龟-侧按4脚开关 带定位柱; 联系下单店铺卖家 免费技术支持: 联系下单店铺卖家 免费帮你查找封装
U1 = CMP-12105-000055-1: HIGH-PERFORMANCE AND DSP WITH DP; Manufacturer: STMicroelectronics; Number Of Uart Channels: 9; Number Of Pwm Channels: 2; Memory Size: 2MBytes; Number Of Ethernet Channels: 1; Ram Size: 1MBytes; Number Of Timers/Counters: 22; Data Bus Width: 32bits; Core Architecture: ARM Cortex-M4, ARM Cortex-M7; Interface: I2C,SPI,UART,USART,CAN,USB,LIN,IrDA,Ethernet,I2S,SMBus,Other; Number Of Adc Channels: 36; Min Supply Voltage: 1.2V; Number Of A/D Converters: 3; Number Of Spi Channels: 6; Max Supply Voltage: 3.6V; Frequency: 480MHz; Memory Type: FLASH; Number Of I2C Channels: 4; Max Junction Temp: +125°C; Standoff Height: 0.15mm; Number Of I/Os: 168; Device Class L2: Embedded Processors and Controllers; Digikey Description: HIGH-PERFORMANCE AND DSP WITH DP; RoHS: TRUE; Lead Free: Yes; Manufacturer Part Number: STM32H747XIH6; ComponentLink2URL: https://www.st.com/resource/en/datasheet/stm32h747xi.pdf; Mouser Description: STM32 Series 2 MB Flash 1 MB RAM 480 MHz 32-Bit Microcontroller - TFBGA-265; Device Class L1: Integrated Circuits (ICs); Ipc Land Pattern Name: BGA289N80P17X17_1400X1400X110; Category: IC; Device Class L3: Microcontrollers; Ambient Temperature Range High: +85°C; Number Of Cores: 2; Temperature Range High: +125°C; ComponentLink2Description: Datasheet; Automotive: No; Ambient Temperature Range Low: -40°C; Package: TFBGA240+25-A07U; Temperature: -40°C to +125°C; Number Of Usb Channels: 2; Temperature Range Low: -40°C; Height: 1.1mm; Octopart: https://octopart.com/stm32h747xih6-stmicroelectronics-100293943
U2 = CMP-04918-000430-1: IC REG AMOLED DISPL 2OUT 12WSON; Number of Channels: 2; Max Supply Voltage: 5V; Min Supply Voltage: 2.9V; Output Voltage: -5V; Mount: Surface Mount; Case/Package: QFN; Packaging: Tape and Reel; Lead Free: Lead Free; Radiation Hardening: No; Min Operating Temperature: -40°C; Number of Outputs: 2; Max Operating Temperature: 85°C; Number of Pins: 12; RoHS Compliant: Yes; Package Quantity: 3000
U4 = CMP-1518-00018-3: IC PMIC BATT PWR SYST 48VQFN; Number of Outputs: 7; Output Current: 1.2A; Nominal Supply Current: 2.5A; Max Duty Cycle: 100%; Operating Supply Voltage: 5.8V; Output Voltage: 3.3V; Min Operating Temperature: -40°C; Radiation Hardening: No; Package Quantity: 2500; Number of Pins: 48; Mount: Surface Mount; Packaging: Tape and Reel; Lead Free: Lead Free; Max Operating Temperature: 105°C; Case/Package: VQFN; RoHS Compliant: Yes
U5 = IS42S32800G-6BLI: Manufacturer: ISSI(美国芯成); Add into BOM: yes; Name: IS42S32800G-6BLI; Symbol: IS42S32800G-6BLI; Device: IS42S32800G-6BLI; LCSC Part Name: IS42S32800G-6BLI; Supplier Part: C2920767; Manufacturer Part: IS42S32800G-6BLI; Supplier Footprint: TFBGA-90(8x13); JLCPCB Part Class: Extended Part; Datasheet: https://atta.szlcsc.com/upload/public/pdf/source/20220614/2E4F120B9DE0CAEE6B87FE9099754B7F.pdf; Supplier: LCSC; Convert to PCB: yes
U6 = KLM8G1GETF-B041006: Manufacturer: SAMSUNG(三星半导体); Symbol: KLM8G1GETF-B041006_C20622996; Device: KLM8G1GETF-B041006_1; Add into BOM: yes; LCSC Part Name: KLM8G1GETF-B041006; Supplier Part: C20622996; Manufacturer Part: KLM8G1GETF-B041006; Supplier Footprint: FBGA-153(11.5x13); Datasheet: https://atta.szlcsc.com/upload/public/pdf/source/20240221/0DCF3FBB535A67C02EC39E54F7AEA7E4.pdf; Supplier: LCSC; Convert to PCB: yes
U9 = AP6212: WiFi & BT Module
USBC1 = USB-Tyoe-C 16P-2.0: type-C-16pin
X2 X3 = XTAL-4P: 4脚无源晶振(谐振器）; 联系下单店铺卖家 免费帮你查找封装: 联系下单店铺卖家 免费技术支持; BOM名称: 4脚无源晶振(谐振器）
X? = XTAL-2P: 2脚无源晶振(谐振器）; 联系下单店铺卖家 免费帮你查找封装: 联系下单店铺卖家 免费技术支持; BOM名称: 2脚无源晶振(谐振器）